# Altium schematic sheet MiniCoil - Cap Board.SchDoc
size A4; SheetNumber: 1; SheetTotal: 1
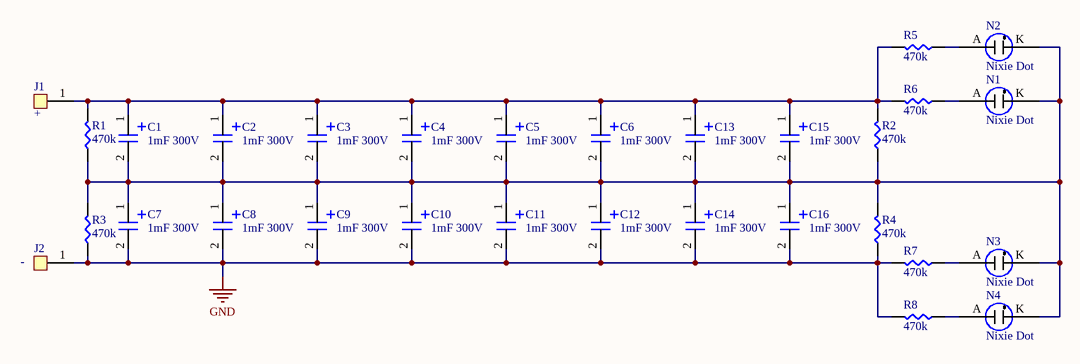
[diagram p0: MiniCoil - Cap Board.SchDoc]

## Parts
C1  1mF 300V  [ELKO 35x50x10]
C2  1mF 300V  [ELKO 35x50x10]
C3  1mF 300V  [ELKO 35x50x10]
C4  1mF 300V  [ELKO 35x50x10]
C5  1mF 300V  [ELKO 35x50x10]
C6  1mF 300V  [ELKO 35x50x10]
C7  1mF 300V  [ELKO 35x50x10]
C8  1mF 300V  [ELKO 35x50x10]
C9  1mF 300V  [ELKO 35x50x10]
C10  1mF 300V  [ELKO 35x50x10]
C11  1mF 300V  [ELKO 35x50x10]
C12  1mF 300V  [ELKO 35x50x10]
C13  1mF 300V  [ELKO 35x50x10]
C14  1mF 300V  [ELKO 35x50x10]
C15  1mF 300V  [ELKO 35x50x10]
C16  1mF 300V  [ELKO 35x50x10]
J1  +  [575-8 Banana Jack]
J2  -  [575-8 Banana Jack]
N1  Nixie Dot  [INS-1]
N2  Nixie Dot  [INS-1]
N3  Nixie Dot  [INS-1]
N4  Nixie Dot  [INS-1]
R1  470k  [SQM-03 3W]
R2  470k  [SQM-03 3W]
R3  470k  [SQM-03 3W]
R4  470k  [SQM-03 3W]
R5  470k  [0207 THT]
R6  470k  [0207 THT]
R7  470k  [0207 THT]
R8  470k  [0207 THT]

## Nets
GND: C7.2 C8.2 C9.2 C10.2 C11.2 C12.2 C14.2 C16.2 J2.1(O) R3.1 R4.1 R7.2 R8.2
NetC1_1: C1.1 C2.1 C3.1 C4.1 C5.1 C6.1 C13.1 C15.1 J1.1(O) R1.2 R2.2 R5.2 R6.2
NetC1_2: C1.2 C2.2 C3.2 C4.2 C5.2 C6.2 C7.1 C8.1 C9.1 C10.1 C11.1 C12.1 C13.2 C14.1 C15.2 C16.1 N1.K N2.K N3.K N4.K R1.1 R2.1 R3.2 R4.2
NetN1_A: N1.A R6.1
NetN2_A: N2.A R5.1
NetN3_A: N3.A R7.1
NetN4_A: N4.A R8.1

## Library data of the parts
C1-C16 = Cap Polar: Supplier 1: Digi-Key; Supplier Part Number 1: 478-9181-1-ND; Supplier 2: Digi-Key; Supplier 3: Digi-Key; Supplier Part Number 2: 478-9173-1-ND; Supplier Part Number 3: 493-11037-ND; Supplier 4: Digi-Key; Supplier 5: Digi-Key; Supplier Part Number 4: PCE3462CT-ND; Supplier Part Number 5: 399-18864-1-ND; Supplier 6: Digi-Key; Supplier Part Number 6: 399-10512-1-ND; Supplier 7: Digi-Key; Supplier Part Number 7: 399-15746-ND; Supplier 8: Digi-Key; Supplier Part Number 8: 1189-3752-1-ND
J1 J2 = Binding Post 1 Pin: Name: name; Supplier 1: Digi-Key; Supplier Part Number 1: 36-575-8-ND
N1-N4 = Nixie Dot: Neon dot indicator
R1-R8 = Resistor